# EAGLE design SparkFun_Qwiic_Mini_UV_Sensor_AS7331 (EAGLE 9.6.2)
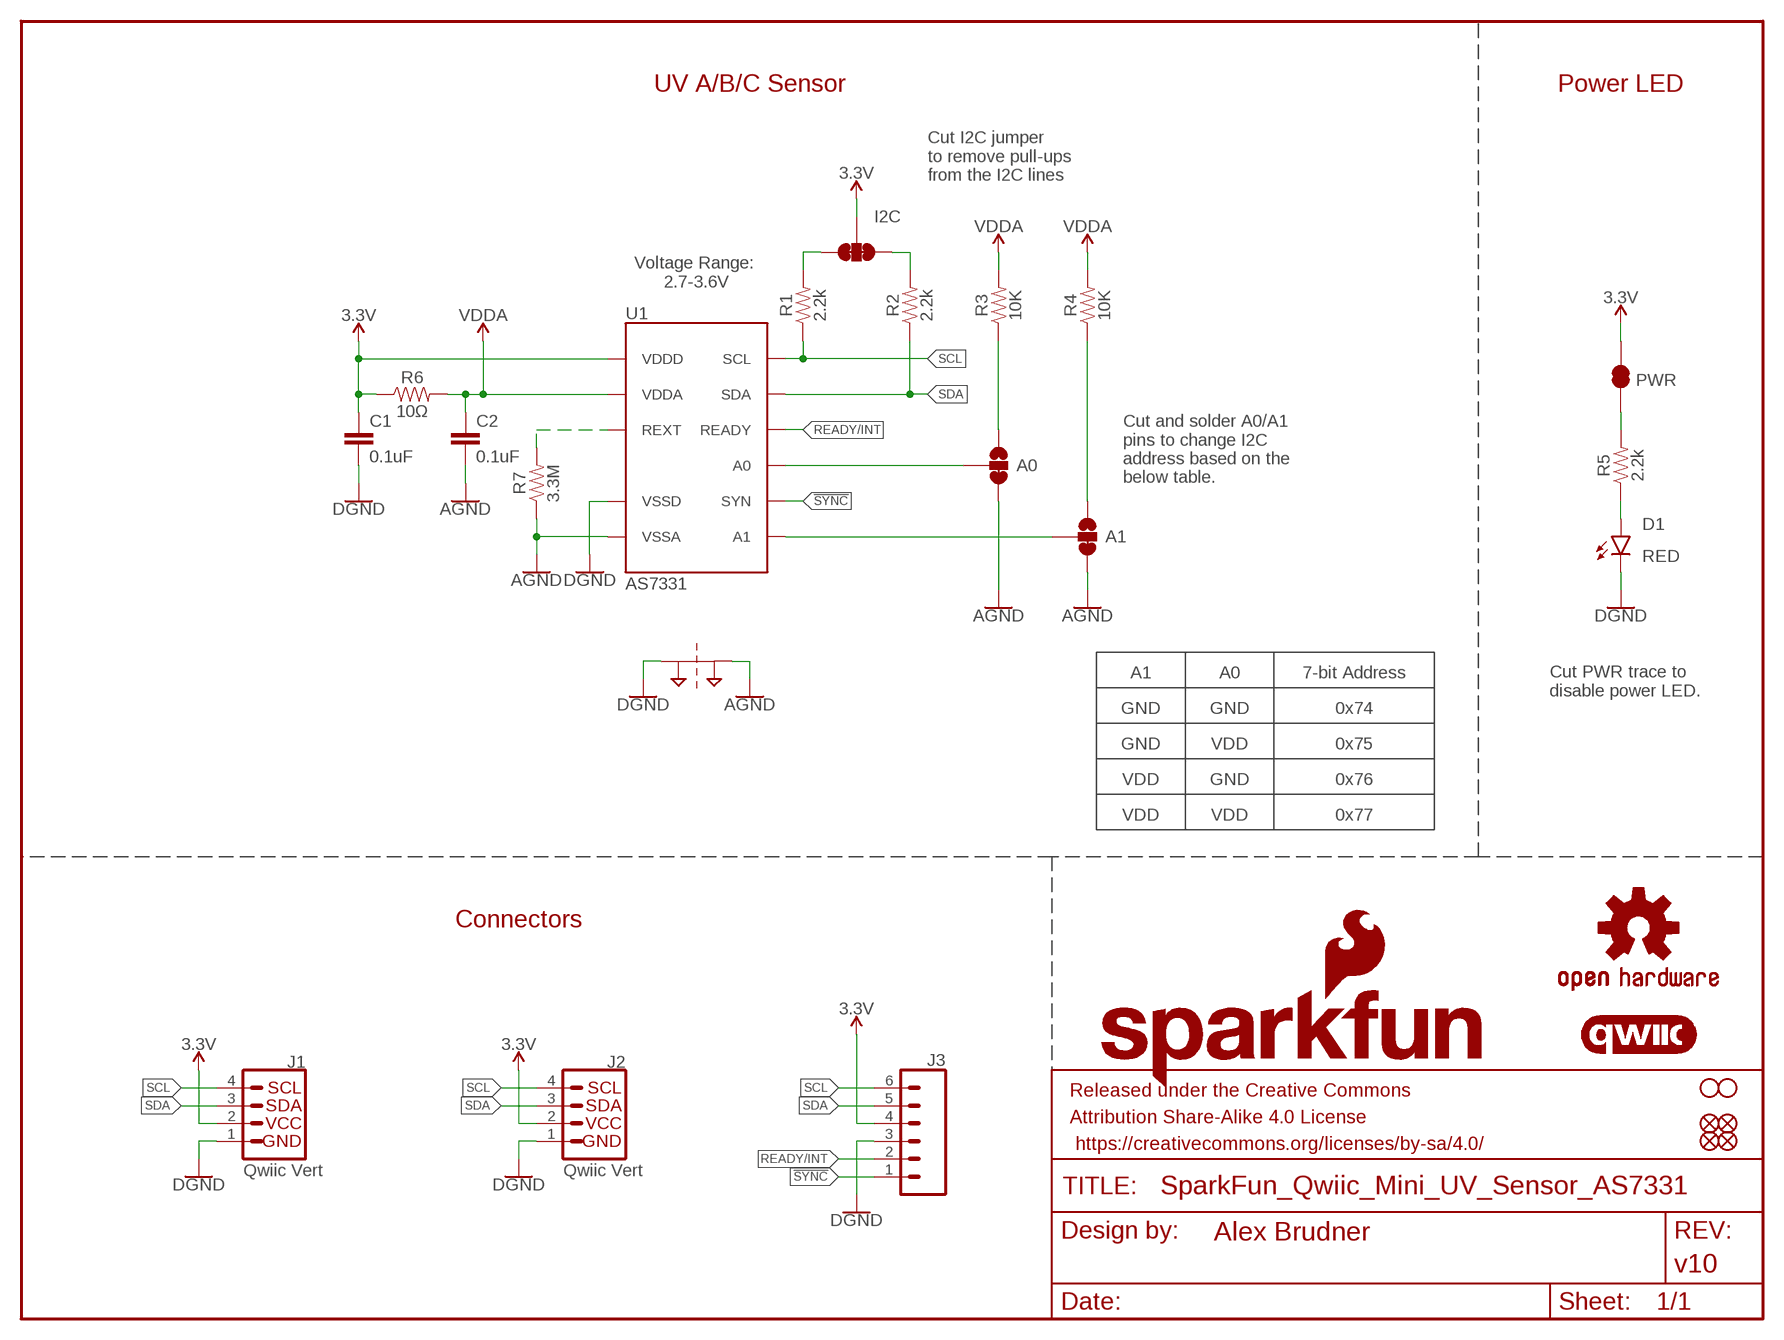
[diagram p0: schematic, sheet 1]

## Parts
A0  JUMPER-SMT_3_1-NC_TRACE_SILK  [SMT-JUMPER_3_1-NC_TRACE_SILK]
A1  JUMPER-SMT_3_1-NC_TRACE_SILK  [SMT-JUMPER_3_1-NC_TRACE_SILK]
C1  0.1uF  0.1UF-0402T-6.3V-10%-X7R  [0402-TIGHT]
C2  0.1uF  0.1UF-0402T-6.3V-10%-X7R  [0402-TIGHT]
D1  RED  LED-RED_0402  [LED-0402]
FD1  FIDUCIALUFIDUCIAL  [FIDUCIAL-MICRO]
FD2  FIDUCIALUFIDUCIAL  [FIDUCIAL-MICRO]
FD3  FIDUCIALUFIDUCIAL  [FIDUCIAL-MICRO]
FD4  FIDUCIALUFIDUCIAL  [FIDUCIAL-MICRO]
FRAME1  FRAME-LETTER  [CREATIVE_COMMONS]
H1  STAND-OFFTIGHT  [STAND-OFF-TIGHT]
H2  STAND-OFFTIGHT  [STAND-OFF-TIGHT]
I2C  JUMPER-SMT_3_2-NC_TRACE_SILK  [SMT-JUMPER_3_2-NC_TRACE_SILK]
J1  Qwiic Vert  QWIIC_CONNECTOR  [JST04_1MM_VERT]
J2  Qwiic Vert  QWIIC_CONNECTOR  [JST04_1MM_VERT]
J3  CONN_06NO_SILK_NO_POP  [1X06_NO_SILK]
LOGO1  SFE_LOGO_NAME.1_INCH  [SFE_LOGO_NAME_.1]
LOGO2  QWIIC_LOGO_CONNECTOR  [QWIIC_5.5MM]
LOGO3  OSHW-LOGOMINI  [OSHW-LOGO-MINI]
LOGO4  SFE_LOGO_FLAME.1_INCH  [SFE_LOGO_FLAME_.1]
PWR  JUMPER-SMT_2_NC_TRACE_SILK  [SMT-JUMPER_2_NC_TRACE_SILK]
R1  2.2k  2.2KOHM-0402T-1/16W-1%  [0402-TIGHT]
R2  2.2k  2.2KOHM-0402T-1/16W-1%  [0402-TIGHT]
R3  10K  10KOHM-0402-1/10W-0.1%  [0402-TIGHT]
R4  10K  10KOHM-0402-1/10W-0.1%  [0402-TIGHT]
R5  2.2k  2.2KOHM-0402T-1/16W-1%  [0402-TIGHT]
R6  10Ω  10OHM-0402-1/16W-5%  [0402-TIGHT]
R7  3.3M  3.3MOHM  [1206]
SUPPLYTIE1  2PT_GND_TIE  [2PT_GND_TIE]
U1  AS7331  UV_SENSOR_AS7331  [OLGA16]

## Nets
3.3V: C1.1 I2C.2 J1.2 J2.2 J3.4 PWR.2 R6.1 U1.10(VDDD)
!SYNC: J3.1 U1.8(SYN)
A0: A0.2 U1.14(A0)
A1: A1.2 U1.7(A1)
AGND: A0.3 A1.3 C2.2 R7.1 SUPPLYTIE1.P$2 U1.1(VSSA) U1.2(VSSA) U1.5(VSSA) U1.6(VSSA) U1.15(VSSA) U1.16(VSSA)
GND: C1.2 D1.C J1.1 J2.1 J3.3 SUPPLYTIE1.P$1 U1.11(VSSD) ; supply symbol labelled DGND
N$1: A0.1 R3.1
N$2: A1.1 R4.1
N$3: I2C.3 R1.2
N$5: I2C.1 R2.2
N$7: PWR.1 R5.2
N$8: R7.2 U1.4(REXT)
N$9: D1.A R5.1
READY/INT: J3.2 U1.9(READY)
SCL: J1.4 J2.4 J3.6 R1.1 U1.13(SCL)
SDA: J1.3 J2.3 J3.5 R2.1 U1.12(SDA)
VDDA: C2.1 R3.2 R4.2 R6.2 U1.3(VDDA)

## Notes on the sheet
- UV A/B/C Sensor | Power LED
- Cut I2C jumper 
  to remove pull-ups 
  from the I2C lines
- Voltage Range: 
  2.7-3.6V
- Cut and solder A0/A1 
  pins to change I2C 
  address based on the 
  below table.
- A1 | A0 | 7-bit Address
- Cut PWR trace to
  disable power LED.
- GND | GND | 0x74
- GND | VDD | 0x75
- VDD | GND | 0x76
- VDD | VDD | 0x77
- Connectors

## Library data of the parts
A0 A1 = SparkFun-Jumpers:JUMPER-SMT_3_1-NC_TRACE: Normally closed trace jumper (1 of 2 connections) This jumper has a trace between two pads so it's normally closed (NC). The other connection is normally open (NO). Use a razor knife to open the connection. For best results follow the IPC guidelines for cutting traces: Cutout at least 0.063 mm (0.005 in). Remove all loose material to clean up the cut area. Seal the cut with an approved epoxy. Reapply solder to reclose the connection, or to close the NO connection.
C1 C2 = SparkFun-Capacitors:0.1UF: 0.1µF ceramic capacitors A capacitor is a passive two-terminal electrical component used to store electrical energy temporarily in an electric field.; PROD_ID: CAP-14993
D1 = SparkFun-LED:LED-RED: Red SMD LED Used in manufacturing of most products at SparkFun Packages: 0603 - KB - KingBright (DIO-17976) SMD 0603 package [Datasheet] <https://www.kingbrightusa.com/images/catalog/SPEC/APT1608SURCK.pdf> 0603 - (DIO-00819, has gone EOL) SMD 0603 package 0603 SMART - SMD 0603 SMART package ( more efficient and expensive)[Product Link] <http://www.osram-os.com/Graphics/XPic2/00077099_0.pdf> 1206 - SMD1206 package [Product Link] <https://www.sparkfun.com/datasheets/DevTools/LilyPad/Q150OVS4.pdff> SparkFun Products: Pro Mini 328 -5V <https://www.sparkfun.com/products/821> RedBoard <https://www.sparkfun.com/products/12757> IOIO-OTG <https://www.sparkfun.com/products/13613>; PROD_ID: DIO-16757
FD1-FD4 = SparkFun-Aesthetics:FIDUCIAL: Fiducial Alignment Points Point-of-reference for pick-and-place machines and other optical instruments.
FRAME1 = SparkFun-Aesthetics:FRAME-LETTER: Schematic Frame - Letter Standard 8.5x11 US Letter frame; DESIGNER: Alex Brudner; REV: v10
H1 H2 = SparkFun-Hardware:STAND-OFF: Stand Off Drill holes for mechanically mounting via screws, standoffs, etc. Note: Use the keepout ring to avoid running the screw head into surrounding components. Variant Overviews STAND-OFF - Mechanical footprint for a #4 phillips button head screw. STAND-OFF-TIGHT - Mechanical footprint for a #4 phillips button head screw, Example SparkFun Products Screw - Phillips Head (1/4", 4-40, 10 pack) <https://www.sparkfun.com/products/10453> (PRT-10453) Screw - Phillips Head (1/2", 4-40, 10 pack) <https://www.sparkfun.com/products/10452> (PRT-10452) Screw - Phillips Head (3/4", 4-40, 10 pack) <https://www.sparkfun.com/products/10451> (PRT-10451) Screw - Phillips Head (1", 4-40, 10 pack) <https://www.sparkfun.com/products/10450> (PRT-10450)
I2C = SparkFun-Jumpers:JUMPER-SMT_3_2-NC_TRACE: Normally closed trace jumper (2 of 2 connections) This jumper has a trace between all three pads so they are normally closed (NC). Use a razor knife to open the connection(s). For best results follow the IPC guidelines for cutting traces: Cutout at least 0.063 mm (0.005 in). Remove all loose material to clean up the cut area. Seal the cut with an approved epoxy. Reapply solder to reclose the connection(s).
J1 J2 = SparkFun-Connectors:QWIIC_CONNECTOR: SparkFun I2C Standard Qwiic Connector An SMD 1mm pitch JST connector makes it easy and quick (get it? Qwiic?) to connect I2C devices to each other. The Qwiic system <http://www.sparkfun.com/qwiic> enables fast and solderless connection between popular platforms and various sensors and actuators. We carry 200mm <https://www.sparkfun.com/products/14204>, 100mm <https://www.sparkfun.com/products/14205>, 50mm <https://www.sparkfun.com/products/14206>, and breadboard friendly <https://www.sparkfun.com/products/14207> Qwiic cables. We also offer 10 pcs strips <https://www.sparkfun.com/products/14323> the SMD connectors.; PROD_ID: CONN-14483; VALUE: Vertical Qwiic Connector
J3 = SparkFun-Connectors:CONN_06: Multi connection point. Often used as Generic Header-pin footprint for 0.1 inch spaced/style header connections On any of the 0.1 inch spaced packages, you can populate with these: Break Away Headers - Straight <https://www.sparkfun.com/products/116> (PRT-00116) Break Away Male Headers - Right Angle <https://www.sparkfun.com/products/553> (PRT-00553) Female Headers <https://www.sparkfun.com/products/115> (PRT-00115) Break Away Headers - Machine Pin <https://www.sparkfun.com/products/117> (PRT-00117) Break Away Female Headers - Swiss Machine Pin <https://www.sparkfun.com/products/743> (PRT-00743) Arduino Stackable Header - 6 Pin <https://www.sparkfun.com/products/9280> (PRT-09280) Screw Terminals 2.54mm Pitch (6-Pin) <https://www.sparkfun.com/products/16499> (PRT-16499) For SCREWTERMINALS and SPRING TERMINALS visit here: Screw Terimnals on SparkFun.com <https://www.sparkfun.com/search/results?term=Screw+Terminals> (5mm/3.5mm/2.54mm spacing) This device is also useful as a general connection point to wire up your design to another part of your project. Our various solder wires solder well into these plated through hole pads. Hook-Up Wire - Assortment (Stranded, 22 AWG) <https://www.sparkfun.com/products/11375> (PRT-11375) Hook-Up Wire - Assortment (Solid Core, 22 AWG) <https://www.sparkfun.com/products/11367> (PRT-11367) View the entire wire category on our website here <https://www.sparkfun.com/categories/141>
LOGO1 = SparkFun-Aesthetics:SFE_LOGO_NAME: SparkFun Font Logo This is the SparkFun name logo. The logo on the schematic will always be the same size; the package variant is the height of the flame part of the logo (or the height the flame would be, if it were drawn). Default layer for the logo on the board is tSilk.
LOGO2 = SparkFun-Aesthetics:QWIIC_LOGO: Qwiic Logos for placement on schematic and PCB. The 5.5mm silk logo is best for placing next to Qwiic connector.
LOGO3 = SparkFun-Aesthetics:OSHW-LOGO: Open-Source Hardware (OSHW) Logo This logo indicates the piece of hardware it is found on incorporates a OSHW license and/or adheres to the definition of open source hardware found here: http://freedomdefined.org/OSHW
LOGO4 = SparkFun-Aesthetics:SFE_LOGO_FLAME: SparkFun Flame Logo This is the SparkFun flame logo. The logo on the schematic will always be the same size; the package variant is the height of the flame. Default layer for the logo on the board is tSilk.
PWR = SparkFun-Jumpers:JUMPER-SMT_2_NC_TRACE: Normally closed trace jumper This jumper has a trace between two pads so it's normally closed (NC). Use a razor knife to open the connection. For best results follow the IPC guidelines for cutting traces: Cutout at least 0.063 mm (0.005 in). Remove all loose material to clean up the cut area. Seal the cut with an approved epoxy. Reapply solder to reclose the connection.
R1 R2 R5 = SparkFun-Resistors:2.2KOHM: 2.2kΩ resistor A resistor is a passive two-terminal electrical component that implements electrical resistance as a circuit element. Resistors act to reduce current flow, and, at the same time, act to lower voltage levels within circuits. - Wikipedia; PROD_ID: RES-14341
R3 R4 = SparkFun-Resistors:10KOHM: 10kΩ resistor A resistor is a passive two-terminal electrical component that implements electrical resistance as a circuit element. Resistors act to reduce current flow, and, at the same time, act to lower voltage levels within circuits. - Wikipedia; PROD_ID: RES-16147
R6 = SparkFun-Resistors:10OHM: 10Ω resistor A resistor is a passive two-terminal electrical component that implements electrical resistance as a circuit element. Resistors act to reduce current flow, and, at the same time, act to lower voltage levels within circuits. - Wikipedia; PROD_ID: RES-16072
R7 = SparkFun_Qwiic_UV_Sensor_AS7331:3.3MOHM; PN: MCA1206MD3304BP500; PROD_ID: RES-20093
SUPPLYTIE1 = SparkFun-PowerSymbols:2PT_GND_TIE: Dual Ground Supply Power supply symbol for connecting two grounds. SparkFun Products: SparkFun AutoDriver - Stepper Motor Driver <https://www.sparkfun.com/products/11611>
U1 = SparkFun_Qwiic_UV_Sensor_AS7331:UV_SENSOR_AS7331; PROD_ID: IC-20090

## Board
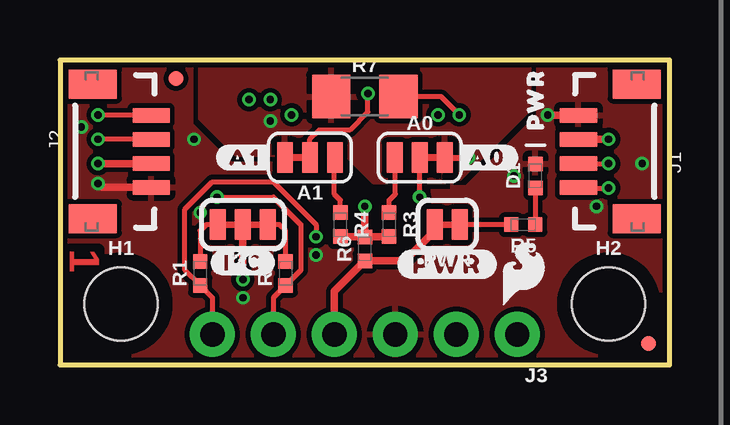
[diagram p1: board, top side]
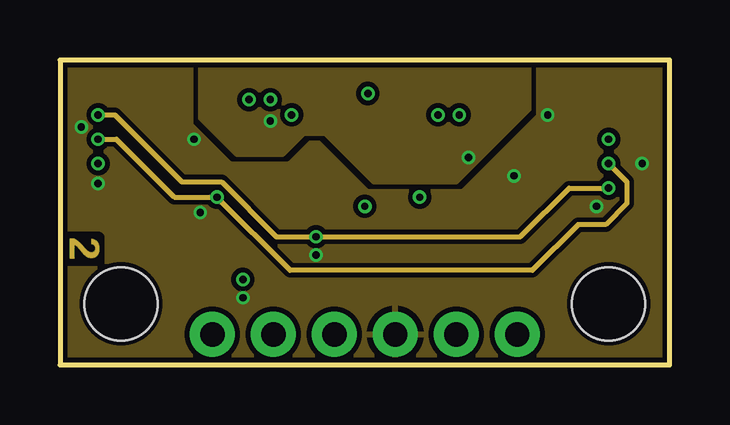
[diagram p2: board, inner layer Route2]
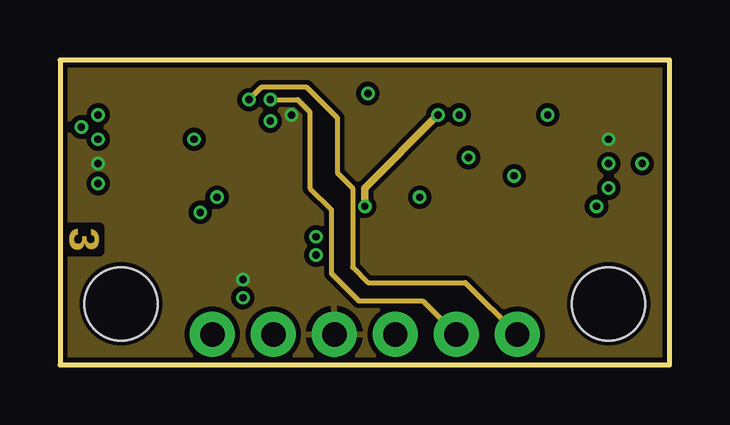
[diagram p3: board, inner layer Route15]
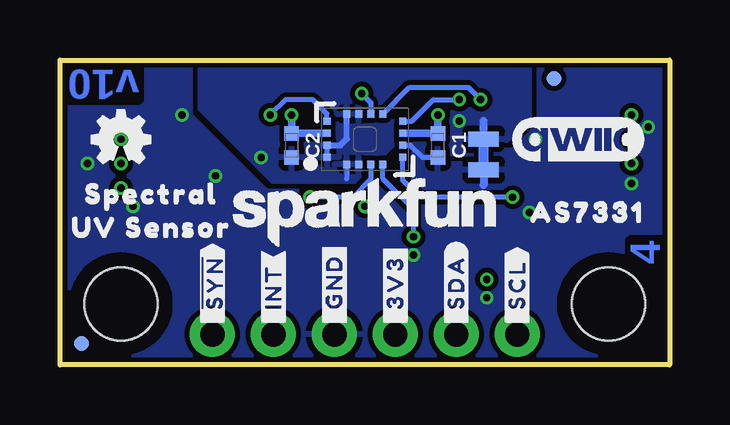
[diagram p4: board, bottom side, seen from below]

Size 25.4 x 12.7 mm. Coordinates in mm from the lower left corner, seen from the top.
Outline: 0,0 25.4,0 25.4,12.7 0,12.7 0,0
Copper layers (1*2*15*16): Top 0.035559375mm / dielectric 0.47751875mm / Route2 0.035559375mm / dielectric 0.47751875mm / Route15 0.035559375mm / dielectric 0.47751875mm / Bottom 0.035559375mm
Design rules "SparkFun-4-Layer-Minimum-JLCPCB": minimum track width 5mil, minimum drill 0.2mm, track to track 5mil, track to pad 5mil, pad to pad 5mil, via to via 5mil, smd to smd 5mil, copper to edge 7mil, drill to drill 7mil, minimum pad ring 5mil, minimum via ring 5mil, stop-mask expansion 2.5mil, vias tented up to drill 25mil, thermal gap 10mil
tRestrict: area 16.1,7.7 to 16.4,7.9

### Footprints (pad centres in the part's own frame; a part is rotated, then mirrored left to right if it is on the bottom)
SMT-JUMPER_3_1-NC_TRACE_SILK = smd 0.66 x 1.27: 1 -1.041,0; 2 0,0; 3 1.041,0
0402-TIGHT = smd 0.6 x 0.6: 1 -0.5,0; 2 0.5,0
LED-0402 = smd 0.6 x 0.6: A -0.5,0; C 0.5,0
FIDUCIAL-MICRO = smd 0.635 x 0.635: 1 0,0
STAND-OFF-TIGHT = hole 3.048: 0,0
SMT-JUMPER_3_2-NC_TRACE_SILK = smd 0.66 x 1.27: 1 -1.041,0; 2 0,0; 3 1.041,0
JST04_1MM_VERT = smd 0.6 x 1.55: 1 -1.5,0.775; 2 -0.5,0.775; 3 0.5,0.775; 4 1.5,0.775 | smd 1.2 x 2: NC1 -2.8,3.2; NC2 2.8,3.2
1X06_NO_SILK = drill 1.016 pad 1.88: 1 0,0; 2 2.54,0; 3 5.08,0; 4 7.62,0; 5 10.16,0; 6 12.7,0
SMT-JUMPER_2_NC_TRACE_SILK = smd 0.66 x 1.27: 1 -0.521,0; 2 0.521,0
1206 = smd 1.6 x 1.8: 1 -1.4,0; 2 1.4,0
2PT_GND_TIE = smd 1.27 x 0.635: P$1 0,0.635; P$2 0,-0.635
OLGA16 = smd 0.3 x 0.3: 1 -0.75,1.575; 2 -0.25,1.575; 3 0.25,1.575; 4 0.75,1.575; 5 1.05,0.75; 6 1.05,0.25; 7 1.05,-0.25; 8 1.05,-0.75; 9 0.75,-1.575; 10 0.25,-1.575; 11 -0.25,-1.575; 12 -0.75,-1.575; 13 -1.05,-0.75; 14 -1.05,-0.25; 15 -1.05,0.25; 16 -1.05,0.75

### Placement (x,y rotation side)
A0  14.99,8.64 0 top
A1  10.41,8.64 180 top
C1  9.65,9.14 270 bottom
C2  15.75,9.14 270 bottom
D1  19.81,7.87 90 top
FD1  4.83,11.94 0 top
FD2  24.51,0.89 0 top
FD3  4.83,11.94 0 bottom
FD4  24.51,0.89 0 bottom
FRAME1  21.08,-21.59 0 top  (outside the outline)
H1  2.54,2.54 0 top
H2  22.86,2.54 0 top
I2C  7.62,5.84 180 top
J1  20.83,8.89 270 top
J2  4.57,8.89 90 top
J3  19.05,1.27 180 top
LOGO1  12.7,6.35 0 bottom
LOGO2  3.81,9.4 0 bottom
LOGO3  22.86,9.4 0 bottom
LOGO4  19.3,3.81 0 top
PWR  16.13,5.84 180 top
R1  5.84,3.81 90 top
R2  9.4,3.81 90 top
R3  13.72,5.84 270 top
R4  11.68,5.84 270 top
R5  19.3,5.84 180 top
R6  12.7,4.83 90 top
R7  12.7,11.18 0 top
SUPPLYTIE1  7.75,8.76 180 bottom
U1  12.7,9.4 90 bottom
U$6  [#I�C#0]  7.62,4.25 0 top
U$7  [#A0#0]  16.51,8.64 0 top
U$8  [#A1#0]  8.89,8.64 0 top
U$9  [#PWR#0]  16.13,4.19 0 top
U$10  [PWR0]  19.81,11.05 90 top
U$11  [#_SCL#0]  6.35,1.52 90 bottom
U$12  [#_SDA#0]  8.89,1.52 90 bottom
U$13  [#_3V3#0]  11.43,1.52 90 bottom
U$14  [#_GND#0]  13.97,1.52 90 bottom
U$15  [#_INT#0]  16.51,1.52 90 bottom
U$17  [UV_SENSOR0]  21.59,5.71 0 bottom
U$18  [AS73310]  3.43,6.35 0 bottom
U$19  [ORDERING_INSTRUCTIONS]  27.56,38.23 0 top  (outside the outline)
U$20  [SPECTRAL0]  21.59,7.11 0 bottom
U$21  [#_#SYN##0]  19.05,1.52 90 bottom

### Tracks (layer width: path | path; a pad name or v marks a point on that pad's centre or on a via)
3.3V  (via drill 0.3)
  Top 0.254: v22.85,9.39 v22.86,9.4 | J2.2 3.79,8.38
  Top 0.305: J1.2 v22.85,9.39 | 3.79,8.38 v1.59,8.38 | J3.4 11.43,3.06 R6.1 14.36,4.33 15.61,5.58 PWR.2 | I2C.2 v7.62,3.56
  Bottom 0.203: U1.10
  Bottom 0.305: v9.65,10.41 C1.1 10.77,9.64 U1.10
  pour Route15 (isolate 0.203, rank 2): 0,12.7 0,0 25.4,0 25.4,12.7
!SYNC  (via drill 0.3)
  Route15 0.203: v7.87,11.05 8.38,11.56 10.29,11.56 11.56,10.29 11.56,8 12.19,7.37 12.19,4.06 12.83,3.43 16.89,3.43 J3.1
  Bottom 0.203: U1.8 10.84,11.56 8.38,11.56 v7.87,11.05
A0  (via drill 0.3)
  Top 0.203: v14.99,6.99 A0.2
  Bottom 0.203: U1.14 12.45,7.74 13.21,6.99 v14.99,6.99
A1  (via drill 0.3)
  Top 0.203: A1.2 10.41,9.4 10.79,9.78 12.06,9.78 12.83,10.54 v12.83,11.3
  Bottom 0.203: v12.83,11.3 12.45,10.93 U1.7
AGND  (via drill 0.3)
  Top 0.254: A0.3 v17.02,8.64
  Bottom 0.203: U1.2 U1.1 | U1.16 13.46,8.34 13.46,7.75
  Bottom 0.254: U1.5 13.45,9.41 13.72,9.14 U1.2
  Bottom 0.33: SUPPLYTIE1.P$2 7.75,10.16
  other vias: 8.76,10.16
  pour Bottom (isolate 0.203): 5.84,12.7 5.84,10.29 7.37,8.76 9.27,8.76 10.16,9.65 11.05,9.65 13.08,7.62 16.51,7.62 19.56,10.67 19.56,12.7
  pour Route2 (isolate 0.203): 5.84,12.7 5.84,10.29 7.37,8.76 9.27,8.76 10.16,9.65 11.05,9.65 13.08,7.62 16.51,7.62 19.56,10.67 19.56,12.7
  pour Top (isolate 0.203): 5.84,12.7 5.84,10.29 7.37,8.76 9.27,8.76 10.16,9.65 11.05,9.65 13.08,7.62 16.51,7.62 19.56,10.67 19.56,12.7
GND  (via drill 0.3)
  Top 0.305: J2.1 1.75,7.39 v1.59,7.56 | J1.1 20.34,10.39 v20.32,10.41
  Bottom 0.203: U1.11 10.8,9.15 10.29,8.64 C1.2
  Bottom 0.33: SUPPLYTIE1.P$1 7.75,7.49
  other vias: 10.67,4.57 5.84,6.35 22.35,6.6 0.89,9.91 5.59,9.4 7.62,2.79 24.26,8.38 18.92,7.87
  pour Top (isolate 0.203, rank 2): 0,12.7 0,0 25.4,0 25.4,12.7
  pour Bottom (isolate 0.203, rank 2): 0,12.7 0,0 25.4,0 25.4,12.7
  pour Route2 (isolate 0.203, rank 2): 0,12.7 0,0 25.4,0 25.4,12.7
N$1
  Top 0.203: R3.1 13.72,6.86 13.97,7.11 13.97,8.61 A0.1
N$2
  Top 0.203: R4.1 11.68,6.86 11.43,7.11 11.43,8.61 A1.1
N$3
  Top 0.203: I2C.3 6.1,5.84 5.84,5.59 R1.2
N$5
  Top 0.203: R2.2 9.4,5.59 9.14,5.84 I2C.1
N$7
  Top 0.203: R5.2 PWR.1
N$8  (via drill 0.3)
  Top 0.203: v16.64,10.41 15.88,11.18 R7.2
  Bottom 0.203: U1.4 14.28,10.46 14.86,11.05 16,11.05 v16.64,10.41
N$9
  Top 0.203: D1.A 19.81,5.85 R5.1
READY/INT  (via drill 0.3)
  Route15 0.203: v8.76,11.05 9.91,11.05 10.41,10.54 10.41,7.37 11.3,6.48 11.3,3.81 12.45,2.67 15.11,2.67 J3.2
  Bottom 0.203: U1.9 10.74,10.15 9.84,11.05 v8.76,11.05
SCL  (via drill 0.3)
  Top 0.203: J3.6 6.35,2.8 R1.1 5.21,3.94 5.21,6.48 6.35,7.62 8.89,7.62 10.67,5.84 v10.67,5.33 | J1.4 21.63,7.37 v22.86,7.37 | J2.4 1.61,10.39 v1.59,10.41
  Route2 0.203: v1.59,10.41 2.29,10.41 5.08,7.62 6.73,7.62 9.02,5.33 v10.67,5.33 19.18,5.33 21.21,7.37 v22.86,7.37
  Bottom 0.203: v10.67,5.33 10.67,6.48 11.95,7.76 U1.13
SDA  (via drill 0.3)
  Top 0.203: J3.5 8.89,2.8 R2.1 10.03,3.94 10.03,5.84 8.89,6.99 v6.54,6.99 | J1.3 21.61,8.38 v22.86,8.38 | J2.3 v1.59,9.39 v1.59,9.4
  Route2 0.203: v1.59,9.4 2.35,9.4 4.76,6.99 v6.54,6.99 9.59,3.94 19.68,3.94 21.59,5.84 22.73,5.84 23.62,6.73 23.62,7.62 v22.86,8.38
  Bottom 0.203: v6.54,6.99 10.41,6.99 11.12,7.7 U1.12
VDDA  (via drill 0.3)
  Top 0.305: R4.2 12.68,5.34 R6.2 | R3.2 13.7,5.33 R6.2 | R6.2 v12.7,6.6
  Route15 0.305: v15.75,10.41 12.7,7.37 v12.7,6.6
  Bottom 0.254: C2.1
  Bottom 0.305: U1.3 C2.1 | C2.1 v15.75,10.41

### Text on the board
Top: 1
Route2: 2
Route15: 3
Bottom: v10 | 4
Measures: All Units in Inches
tDocu: Thickness: 1.6mm / Stackup: JLC7628 / Layers: 4 / Copper: 1oz outer, 0.5 oz inner / Material: FR-4 TG 135-140 / Solder Mask Color: Red / Silkscreen: White / Finish: Lead-Free HASL | Alex Brudner